# Altium schematic sheet BU04_Kit_Sch.SchDoc
size A; SheetNumber: 1; SheetTotal: 1
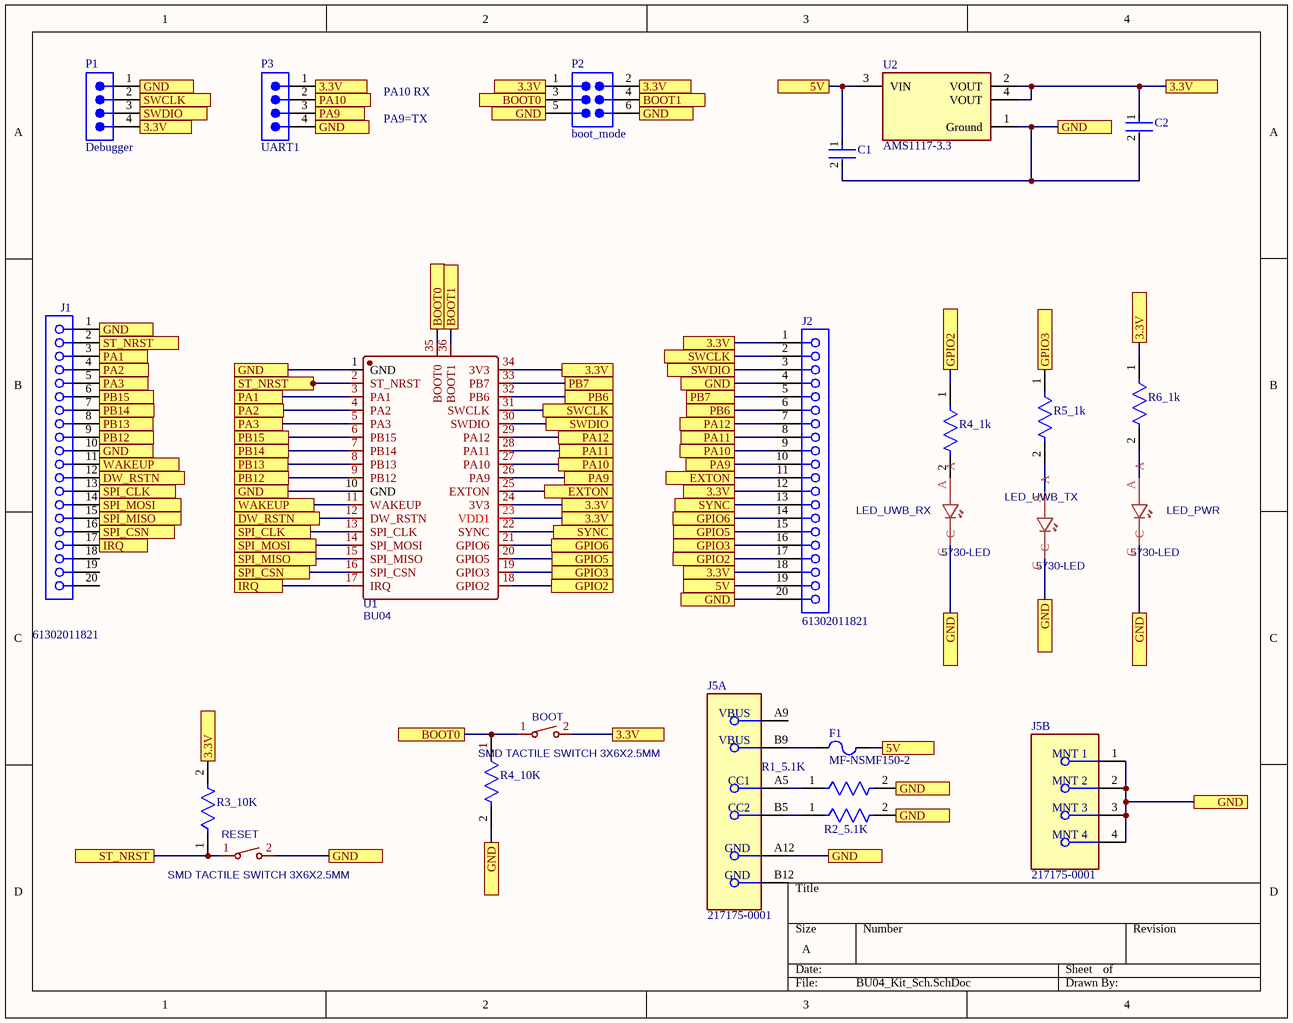
[diagram p0: BU04_Kit_Sch.SchDoc]

## Parts
BOOT  SMD TACTILE SWITCH 3X6X2.5MM  [SW-SMD_L6.0-W3.5-LS8.0]
C1  GCJ32ER71E106MA18L  [FP-GCJ32E-0_4-0_3-MFG]  (value not drawn)
C2  GCJ32ER71E106MA18L  [FP-GCJ32E-0_4-0_3-MFG]  (value not drawn)
F1  MF-NSMF150-2  [BOUR-MF-NSMF150-2_V]
J1  61302011821  [61302011821]
J2  61302011821  [61302011821]
J5  217175-0001  [FP-217175-0001-MFG]  (parts A,B of 2)
LED_PWR  5730-LED  [5730-LED]
LED_UWB_RX  5730-LED  [5730-LED]
LED_UWB_TX  5730-LED  [5730-LED]
P1  Debugger  [SMTC-MTSW-104-07-X-S-170]
P2  boot_mode  [SMTC-MTSW-103-07-X-D-244]
P3  UART1  [SMTC-MTSW-104-07-X-S-170]
R1_5.1K  AF0603FR-075K1L  [FP-AF0603-MFG]  (value not drawn)
R2_5.1K  AF0603FR-075K1L  [FP-AF0603-MFG]  (value not drawn)
R3_10K  AF0603FR-075K1L  [FP-AF0603-MFG]  (value not drawn)
R4_1k  AF0603FR-075K1L  [FP-AF0603-MFG]  (value not drawn)
R4_10K  AF0603FR-075K1L  [FP-AF0603-MFG]  (value not drawn)
R5_1k  AF0603FR-075K1L  [FP-AF0603-MFG]  (value not drawn)
R6_1k  AF0603FR-075K1L  [FP-AF0603-MFG]  (value not drawn)
RESET  SMD TACTILE SWITCH 3X6X2.5MM  [SW-SMD_L6.0-W3.5-LS8.0]
U1  BU04  [WIRELM-SMD_BU04]
U2  AMS1117-3.3  [FP-AMS1117-IPC_C]

## Ports
3.3V (see BU04_Kit_Sch[1A], BU04_Kit_Sch[1C], BU04_Kit_Sch[2A], BU04_Kit_Sch[2B], BU04_Kit_Sch[2C], BU04_Kit_Sch[3B], BU04_Kit_Sch[3C], BU04_Kit_Sch[4A]), 3.3V (see BU04_Kit_Sch[1A], BU04_Kit_Sch[1C], BU04_Kit_Sch[2A], BU04_Kit_Sch[2B], BU04_Kit_Sch[2C], BU04_Kit_Sch[3B], BU04_Kit_Sch[3C], BU04_Kit_Sch[4A], BU04_Kit_Sch[4B]), 3.3V (see BU04_Kit_Sch[1A], BU04_Kit_Sch[1C], BU04_Kit_Sch[2A], BU04_Kit_Sch[2B], BU04_Kit_Sch[2C], BU04_Kit_Sch[3B], BU04_Kit_Sch[3C], BU04_Kit_Sch[4B]), 3.3V (see BU04_Kit_Sch[1A], BU04_Kit_Sch[1C], BU04_Kit_Sch[2A], BU04_Kit_Sch[2B], BU04_Kit_Sch[2C], BU04_Kit_Sch[3B], BU04_Kit_Sch[4A], BU04_Kit_Sch[4B]), 3.3V (see BU04_Kit_Sch[1A], BU04_Kit_Sch[2A], BU04_Kit_Sch[2B], BU04_Kit_Sch[2C], BU04_Kit_Sch[3B], BU04_Kit_Sch[3C], BU04_Kit_Sch[4A], BU04_Kit_Sch[4B]), 5V (see BU04_Kit_Sch[3A], BU04_Kit_Sch[3C]), 5V (see BU04_Kit_Sch[3C]), BOOT0 (see BU04_Kit_Sch[2A], BU04_Kit_Sch[2B]), BOOT0 (see BU04_Kit_Sch[2A], BU04_Kit_Sch[2C]), BOOT0 (see BU04_Kit_Sch[2B], BU04_Kit_Sch[2C]), BOOT1 (see BU04_Kit_Sch[2A]), BOOT1 (see BU04_Kit_Sch[2B]), DW_RSTN (see BU04_Kit_Sch[1B]), DW_RSTN (see BU04_Kit_Sch[1C]), EXTON (see BU04_Kit_Sch[2B]), EXTON (see BU04_Kit_Sch[3B]), GND (see BU04_Kit_Sch[1A], BU04_Kit_Sch[1B], BU04_Kit_Sch[2A], BU04_Kit_Sch[2D], BU04_Kit_Sch[3B], BU04_Kit_Sch[3C], BU04_Kit_Sch[3D], BU04_Kit_Sch[4A], BU04_Kit_Sch[4C]), GND (see BU04_Kit_Sch[1A], BU04_Kit_Sch[1B], BU04_Kit_Sch[2A], BU04_Kit_Sch[2D], BU04_Kit_Sch[3B], BU04_Kit_Sch[3C], BU04_Kit_Sch[3D], BU04_Kit_Sch[4A], BU04_Kit_Sch[4C], BU04_Kit_Sch[4D]), GND (see BU04_Kit_Sch[1A], BU04_Kit_Sch[1B], BU04_Kit_Sch[2A], BU04_Kit_Sch[2D], BU04_Kit_Sch[3B], BU04_Kit_Sch[3C], BU04_Kit_Sch[3D], BU04_Kit_Sch[4C], BU04_Kit_Sch[4D]), GND (see BU04_Kit_Sch[1A], BU04_Kit_Sch[1B], BU04_Kit_Sch[2A], BU04_Kit_Sch[2D], BU04_Kit_Sch[3C], BU04_Kit_Sch[3D], BU04_Kit_Sch[4A], BU04_Kit_Sch[4C], BU04_Kit_Sch[4D]), GPIO2 (see BU04_Kit_Sch[2C], BU04_Kit_Sch[3B]), GPIO2 (see BU04_Kit_Sch[2C], BU04_Kit_Sch[3C]), GPIO2 (see BU04_Kit_Sch[3B], BU04_Kit_Sch[3C]), GPIO3 (see BU04_Kit_Sch[2C], BU04_Kit_Sch[3C]), GPIO3 (see BU04_Kit_Sch[2C], BU04_Kit_Sch[4B]), GPIO3 (see BU04_Kit_Sch[3C], BU04_Kit_Sch[4B]), GPIO5 (see BU04_Kit_Sch[2C]), GPIO5 (see BU04_Kit_Sch[3C]), GPIO6 (see BU04_Kit_Sch[2C]), GPIO6 (see BU04_Kit_Sch[3C]), IRQ (see BU04_Kit_Sch[1C]), PA1 (see BU04_Kit_Sch[1B]), PA2 (see BU04_Kit_Sch[1B]), PA3 (see BU04_Kit_Sch[1B]), PA9 (see BU04_Kit_Sch[1A], BU04_Kit_Sch[2B]), PA9 (see BU04_Kit_Sch[1A], BU04_Kit_Sch[3B]), PA9 (see BU04_Kit_Sch[2B], BU04_Kit_Sch[3B]), PA10 (see BU04_Kit_Sch[1A], BU04_Kit_Sch[2B]), PA10 (see BU04_Kit_Sch[1A], BU04_Kit_Sch[3B]), PA10 (see BU04_Kit_Sch[2B], BU04_Kit_Sch[3B]), PA11 (see BU04_Kit_Sch[2B]), PA11 (see BU04_Kit_Sch[3B]), PA12 (see BU04_Kit_Sch[2B]), PA12 (see BU04_Kit_Sch[3B]), PB6 (see BU04_Kit_Sch[2B]), PB6 (see BU04_Kit_Sch[3B]), PB7 (see BU04_Kit_Sch[2B]), PB7 (see BU04_Kit_Sch[3B]), PB12 (see BU04_Kit_Sch[1B]), PB13 (see BU04_Kit_Sch[1B]), PB14 (see BU04_Kit_Sch[1B]), PB15 (see BU04_Kit_Sch[1B]), SPI_CLK (see BU04_Kit_Sch[1B]), SPI_CLK (see BU04_Kit_Sch[1C]), SPI_CSN (see BU04_Kit_Sch[1C]), SPI_MISO (see BU04_Kit_Sch[1C]), SPI_MOSI (see BU04_Kit_Sch[1B]), SPI_MOSI (see BU04_Kit_Sch[1C]), ST_NRST (see BU04_Kit_Sch[1B]), ST_NRST (see BU04_Kit_Sch[1B], BU04_Kit_Sch[1D]), SWCLK (see BU04_Kit_Sch[1A], BU04_Kit_Sch[2B]), SWCLK (see BU04_Kit_Sch[1A], BU04_Kit_Sch[3B]), SWCLK (see BU04_Kit_Sch[2B], BU04_Kit_Sch[3B]), SWDIO (see BU04_Kit_Sch[1A], BU04_Kit_Sch[2B]), SWDIO (see BU04_Kit_Sch[1A], BU04_Kit_Sch[3B]), SWDIO (see BU04_Kit_Sch[2B], BU04_Kit_Sch[3B]), SYNC (see BU04_Kit_Sch[2C]), SYNC (see BU04_Kit_Sch[3B]), WAKEUP (see BU04_Kit_Sch[1B])

## Nets
3.3V: BOOT.2 C2.1 J2.1 J2.12 J2.18 P1.4 P2.1 P2.2 P3.1 R3_10K.2 R6_1k.1 U1.23(VDD1) U1.24(3V3) U1.34(3V3) U2.2(VOUT) U2.4(VOUT) ; port 3.3V
5V: C1.1 F1.2 J2.19 U2.3(VIN) ; port 5V
BOOT0: BOOT.1 P2.3 R4_10K.1 U1.35(BOOT0) ; port BOOT0
BOOT1: P2.4 U1.36(BOOT1) ; port BOOT1
DW_RSTN: J1.12 U1.12(DW_RSTN) ; port DW_RSTN
EXTON: J2.11 U1.25(EXTON) ; port EXTON
GND: C1.2 C2.2 J1.1 J1.10 J2.4 J2.20 J5.1(MNT_1) J5.2(MNT_2) J5.3(MNT_3) J5.4(MNT_4) J5.A12(GND) LED_PWR.C LED_UWB_RX.C LED_UWB_TX.C P1.1 P2.5 P2.6 P3.4 R1_5.1K.2 R2_5.1K.2 R4_10K.2 RESET.2 U1.1(GND) U1.10(GND) U2.1(Ground) ; port GND
GPIO2: J2.17 R4_1k.1 U1.18(GPIO2) ; port GPIO2
GPIO3: J2.16 R5_1k.1 U1.19(GPIO3) ; port GPIO3
GPIO5: J2.15 U1.20(GPIO5) ; port GPIO5
GPIO6: J2.14 U1.21(GPIO6) ; port GPIO6
IRQ: J1.17 U1.17(IRQ) ; port IRQ
PA1: J1.3 U1.3(PA1) ; port PA1
PA2: J1.4 U1.4(PA2) ; port PA2
PA3: J1.5 U1.5(PA3) ; port PA3
PA9: J2.10 P3.3 U1.26(PA9) ; port PA9
PA10: J2.9 P3.2 U1.27(PA10) ; port PA10
PA11: J2.8 U1.28(PA11) ; port PA11
PA12: J2.7 U1.29(PA12) ; port PA12
PB6: J2.6 U1.32(PB6) ; port PB6
PB7: J2.5 U1.33(PB7) ; port PB7
PB12: J1.9 U1.9(PB12) ; port PB12
PB13: J1.8 U1.8(PB13) ; port PB13
PB14: J1.7 U1.7(PB14) ; port PB14
PB15: J1.6 U1.6(PB15) ; port PB15
SPI_CLK: J1.13 U1.13(SPI_CLK) ; port SPI_CLK
SPI_CSN: J1.16 U1.16(SPI_CSN) ; port SPI_CSN
SPI_MISO: J1.15 U1.15(SPI_MISO) ; port SPI_MISO
SPI_MOSI: J1.14 U1.14(SPI_MOSI) ; port SPI_MOSI
ST_NRST: J1.2 R3_10K.1 RESET.1 U1.2(ST_NRST) ; port ST_NRST
SWCLK: J2.2 P1.2 U1.31(SWCLK) ; port SWCLK
SWDIO: J2.3 P1.3 U1.30(SWDIO) ; port SWDIO
SYNC: J2.13 U1.22(SYNC) ; port SYNC
WAKEUP: J1.11 U1.11(WAKEUP) ; port WAKEUP
NetF1_1: F1.1 J5.B9(VBUS)
NetJ5_A5: J5.A5(CC1) R1_5.1K.1
NetJ5_B5: J5.B5(CC2) R2_5.1K.1
NetLED_PWR_A: LED_PWR.A R6_1k.2
NetLED_UWB_RX_A: LED_UWB_RX.A R4_1k.2
NetLED_UWB_TX_A: LED_UWB_TX.A R5_1k.2

Not connected (* = marked no-connect by the designer): J1 18 19 20; J5 A9(VBUS) B12(GND)

## Notes on the sheet
- PA10 RX
- PA9=TX

## Library data of the parts
BOOT RESET = SMD TACTILE SWITCH 3X6X2.5MM: Manufacturer: USAKRO; Manufacturer Part: UK-B0240-R-250; Contributor: LCSC; Supplier: LCSC; Supplier Part: C556660; spicePre: S; spiceSymbolName: SMD TACTILE SWITCH 3X6X2.5MM
C1 C2 = CMP-06035-029490-1: Capacitor 10uF ±20%, X7R, 25VDC, SMD 1210 (3225 metric)
F1 = CMP-2000-06693-1: PTC Resettable Fuse, 6 V, 100 A, -40 to 85 degC, 2-Pin SMD, RoHS, Tape and Reel; Manufacturer: Bourns; Trip Current: 3A; Maximum Voltage DC: 6V; Current Rating: 100A; Resistance: 130mOhms; Type: PTCResettableFuses; Hold Current: 1.5A; Maximum Voltage: 6VDC; RoHS: Details; Current Rating (Max): 100A; Datasheet URL: http://www.bourns.com/docs/Product-Datasheets/mfnsmf.pdf; Package Description: 2-Pin Surface Mount Device, Body 3.2 x 1.6 mm; Series: MF-NSMF; Mounting Technology: SurfaceMount; Dimensions: 3.4mmLx1.8mmWx0.7mmH; Termination Style: SMD/SMT; Datasheet Version: Rev. T, 08/2015; Package / Case: 1206(3216metric); Manufacturer URL: http://www.bourns.com/; Product Category: ResettableFuses-PPTC; Packaging: Reel; Brand: Bourns; Mounting Style: SMD/SMT; Package Reference: MF-NSMF150-2; Current Rating - Max: 100A; Tradename: Multifuse; Factory Pack Quantity: 3000; Operating Temperature Range: -40Cto+85C
J1 J2 = CMP-1502-01348-4: THT Vertical Socket Header WR-PHD, Pitch 2.54 mm, Single Row, 20 pins; Contact Resistance: 20mΩ; Gender: Female; Current Rating: 3A; Operating Supply Voltage: 250V; Lead Pitch: 2.54mm; Number of Pins: 20; Orientation: Vertical
J5 = CMP-04767-000026-1: CONN RCP USB2.0 C 6+18P SMD RA
LED_PWR LED_UWB_RX LED_UWB_TX = 5730-LED: Contributor: wystewart; spicePre: ?; spiceSymbolName: 5730-LED
P1 P3 = CMP-1024-00104-1: Modified .025" SQ Post Header, Through-hole, Vertical, -55 to 125 degC, 2.54 mm Pitch, 4-Pin, Male, RoHS; Manufacturer: Samtec; PartNumber: MTSW-104-07-G-S-170; Pitch: 2.54 mm; Temperature Range: -55 to 125 degC; ComponentLink1URL: http://www.samtec.com; ComponentLink1Description: Manufacturer URL; ComponentLink3URL: http://www.samtec.com/documents/webfiles/cpdf/MTSW-XXX-XX-X-X-XXXX-XX-XXX-MKT1.pdf; DatasheetVersion: F-214; Orientation: Vertical; ComponentLink3Description: Package Specification; PackageReference: MTSW-104-07-X-S-170; PackageDescription: Assembly .025" [.64] SQ Post Terminal Strip; ComponentLink2Description: Datasheet; PackageVersion: BI, 2/1987; ComponentLink2URL: http://www.samtec.com/documents/webfiles/pdf/MTSW.PDF; Mounting Technology: Through-hole; RoHS: True
P2 = CMP-1024-00096-1: Modified .025" SQ Post Header, Through-hole, Vertical, -55 to 125 degC, 2.54 mm Pitch, 6-Pin, Male, RoHS; Manufacturer: Samtec; PartNumber: MTSW-103-07-G-D-244; Pitch: 2.54 mm; PackageVersion: BI, 2/1987; ComponentLink3Description: Package Specification; PackageDescription: Assembly .025" [.64] SQ Post Terminal Strip; PackageReference: MTSW-103-07-X-D-244; Temperature Range: -55 to 125 degC; RoHS: True; ComponentLink2URL: http://www.samtec.com/documents/webfiles/pdf/MTSW.PDF; ComponentLink3URL: http://www.samtec.com/documents/webfiles/cpdf/MTSW-XXX-XX-X-X-XXXX-XX-XXX-MKT1.pdf; ComponentLink2Description: Datasheet; ComponentLink1URL: http://www.samtec.com; ComponentLink1Description: Manufacturer URL; Mounting Technology: Through-hole; Orientation: Vertical; DatasheetVersion: F-214
R1_5.1K R2_5.1K = CMP-03412-041991-1: Anti-Sulfurated Chip Resistors Automotive Grade 5.1kΩ 1% 100ppm/°C 0603; Max Power Dissipation: 100mW; Resistance: 5.1kR; Case/Package: 0603; Features: Moisture Resistant; Tolerance: 1%; Packaging: Tape and Reel; Number of Terminations: 2; Max Operating Temperature: 155°C; Height: 0.022inch; Temperature Coefficient: 100ppm/°C; Resistor Type: Thick Film; Width: 0.031inch; Min Operating Temperature: -55°C; Length: 0.063inch; RoHS Compliant: Yes; Series: AF
R3_10K R4_10K = CMP-03412-041991-1: Anti-Sulfurated Chip Resistors Automotive Grade 5.1kΩ 1% 100ppm/°C 0603; Max Power Dissipation: 100mW; Resistance: 10kR; Case/Package: 0603; Features: Moisture Resistant; Tolerance: 1%; Packaging: Tape and Reel; Number of Terminations: 2; Max Operating Temperature: 155°C; Height: 0.022inch; Temperature Coefficient: 100ppm/°C; Resistor Type: Thick Film; Width: 0.031inch; Min Operating Temperature: -55°C; Length: 0.063inch; RoHS Compliant: Yes; Series: AF
R4_1k R5_1k R6_1k = CMP-03412-041991-1: Anti-Sulfurated Chip Resistors Automotive Grade 5.1kΩ 1% 100ppm/°C 0603; Max Power Dissipation: 100mW; Resistance: 1kR; Case/Package: 0603; Features: Moisture Resistant; Tolerance: 1%; Packaging: Tape and Reel; Number of Terminations: 2; Max Operating Temperature: 155°C; Height: 0.022inch; Temperature Coefficient: 100ppm/°C; Resistor Type: Thick Film; Width: 0.031inch; Min Operating Temperature: -55°C; Length: 0.063inch; RoHS Compliant: Yes; Series: AF
U1 = BU04: Manufacturer: Ai-Thinker(安信可); Contributor: lcsc; Supplier: LCSC; Supplier Part: C42420050; Manufacturer Part: BU04; JLCPCB Part Class: Extended Part; spicePre: U; spiceSymbolName: BU04
U2 = CMP-209535-000001-1: LDO Voltage Regulators 1A, 3.3V; Manufacturer: Advanced Monolithic Systems; Dropout Voltage: 1.1V; Output Type: Fixed; Nominal Supply Current: 5mA; Max Power Dissipation: 1.2W; Max Supply Voltage: 15V; Number Of Outputs: 1; Standoff Height: 0.64mm; Max Junction Temp: +125°C; Height: 1.8mm; Package: AMS1117; Device Class L2: Power Management ICs; ComponentLink2Description: Datasheet; ComponentLink2URL: http://www.advanced-monolithic.com/pdf/ds1117.pdf; Category: IC; RoHS: TRUE; Automotive: No; Device Class L1: Integrated Circuits (ICs); Output Current: 1A; Device Class L3: Voltage Regulators - Linear; Temperature: -40°C to +125°C; Output Voltage: 3.3V; Manufacturer Part Number: AMS1117-3.3; Temperature Range Low: -40°C; Octopart: https://octopart.com/ams1117-3.3-advanced+monolithic+systems-25899300; Lead Free: Yes; Ipc Land Pattern Name: SOT229P700X180-4; Temperature Range High: +125°C